# Altium schematic sheet Sheet1.SchDoc
size A4; SheetNumber: 1; SheetTotal: 1
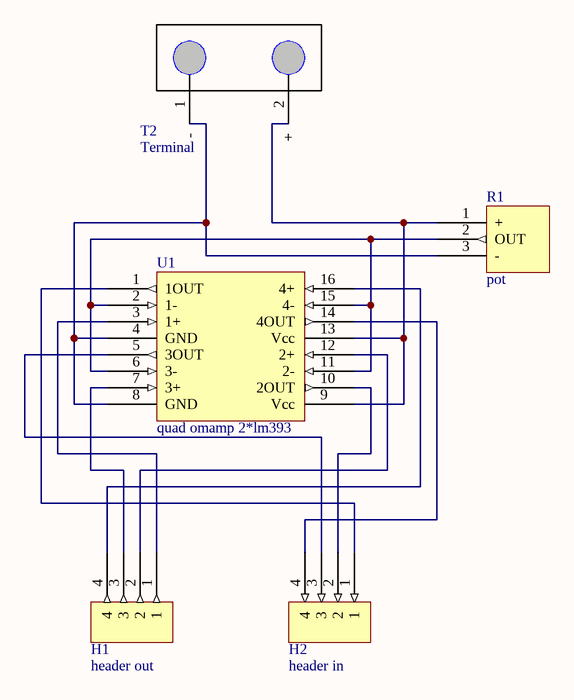
[diagram p0: Sheet1.SchDoc]

## Parts
H1  header out  [headers]
H2  header in  [headers]
R1  pot  [pot]
T2  Terminal  [Terminal]
U1  quad omamp 2*lm393  [quad omamp 2*lm393]

## Nets
NetH1_1: H1.1 U1.3(1+)
NetH1_2: H1.2 U1.12(2+)
NetH1_3: H1.3 U1.7(3+)
NetH1_4: H1.4 U1.16(4+)
NetH2_1: H2.1 U1.1(1OUT)
NetH2_2: H2.2 U1.10(2OUT)
NetH2_3: H2.3 U1.5(3OUT)
NetH2_4: H2.4 U1.14(4OUT)
NetR1_1: R1.1(+) U1.9(Vcc) U1.13(Vcc)
NetR1_2: R1.2(OUT) U1.2(1-) U1.6(3-) U1.11(2-) U1.15(4-)
NetR1_3: R1.3(-) U1.4(GND) U1.8(GND)

Not connected (* = marked no-connect by the designer): T2 1(-) 2(+)